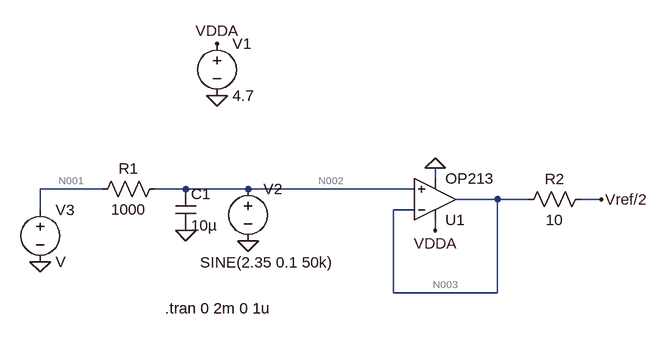
[diagram p0: schematic VrefAmplifierSimulations.asc]
VrefAmplifierSimulations.asc, the LTspice schematic file:
Version 4.1
SHEET 1 880 680
WIRE 256 192 256 176
WIRE -256 208 -352 208
WIRE -128 208 -176 208
WIRE -32 208 -128 208
WIRE 224 208 -32 208
WIRE 352 224 288 224
WIRE 400 224 352 224
WIRE 512 224 480 224
WIRE -352 240 -352 208
WIRE 224 240 192 240
WIRE 256 272 256 256
WIRE 192 368 192 240
WIRE 352 368 352 224
WIRE 352 368 192 368
FLAG -80 64 0
FLAG -80 -16 VDDA
FLAG 256 272 VDDA
FLAG 256 176 0
FLAG -128 272 0
FLAG -32 288 0
FLAG 512 224 Vref/2
FLAG -352 320 0
SYMBOL OpAmps\\OP213 256 288 M180
SYMATTR InstName U1
SYMBOL voltage -80 -32 R0
SYMATTR InstName V1
SYMATTR Value 4.7
SYMBOL res 496 208 R90
WINDOW 0 0 56 VBottom 2
WINDOW 3 32 56 VTop 2
SYMATTR InstName R2
SYMATTR Value 10
SYMBOL voltage -32 192 R0
WINDOW 3 -74 129 Left 2
WINDOW 123 0 0 Left 0
WINDOW 39 0 0 Left 0
SYMATTR InstName V2
SYMATTR Value SINE(2.35 0.1 50k)
SYMBOL res -160 192 R90
WINDOW 0 0 56 VBottom 2
WINDOW 3 32 56 VTop 2
SYMATTR InstName R1
SYMATTR Value 1000
SYMBOL cap -144 208 R0
SYMATTR InstName C1
SYMATTR Value 10µ
SYMBOL voltage -352 224 R0
SYMATTR InstName V3
TEXT -160 392 Left 2 !.tran 0 2m 0 1u

The netlist it stands for:
* VrefAmplifierSimulations.asc
X§U1 N002 N003 VDDA 0 N003 OP213  ; pins In+ In- V+ V- OUT
V1 VDDA 0 4.7
R2 Vref/2 N003 10
V2 N002 0 SINE(2.35 0.1 50k)
R1 N002 N001 1000
C1 N002 0 10µ
V3 N001 0 V
.tran 0 2m 0 1u
.backanno
.end

* Results of the author's LTspice run, read from the files saved beside the schematic
* Operating Point, zero values left out:
*   V(n001) = 2.35 V
*   V(n002) = 2.35 V
*   V(n003) = 2.35 V
*   V(vdda) = 4.7 V
*   V(vref/2) = 2.35 V
*   I(V1) = -1.296 mA
*   I(V2) = 264.8 nA
*   Ix(u1:2) = -214.8 nA
*   Ix(u1:3) = -264.8 nA
*   Ix(u1:4) = -1.296 mA
*   Ix(u1:6) = 214.8 nA
*   Ix(u1:7) = 1.296 mA
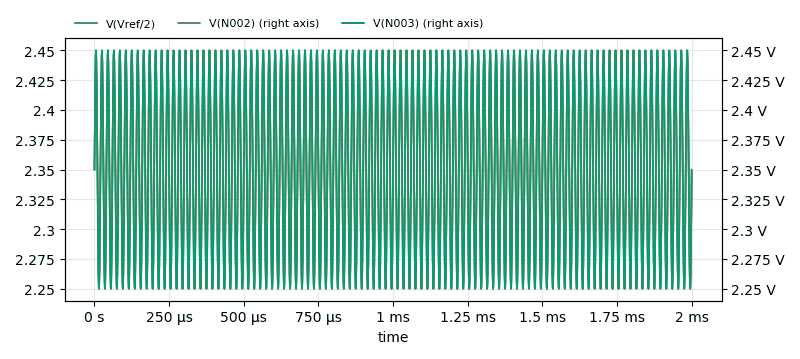
[diagram p1: Transient Analysis of VrefAmplifierSimulations.asc, plotted from the saved traces]
* Transient Analysis, 1 run:
*   V(Vref/2): min 2.25 , max 2.45 , average 2.35 , rms 2.351 , last 2.348 
*   V(N002): min 2.25 V, max 2.45 V, average 2.35 V, rms 2.351 V, last 2.35 V
*   V(N003): min 2.25 V, max 2.45 V, average 2.35 V, rms 2.351 V, last 2.348 V